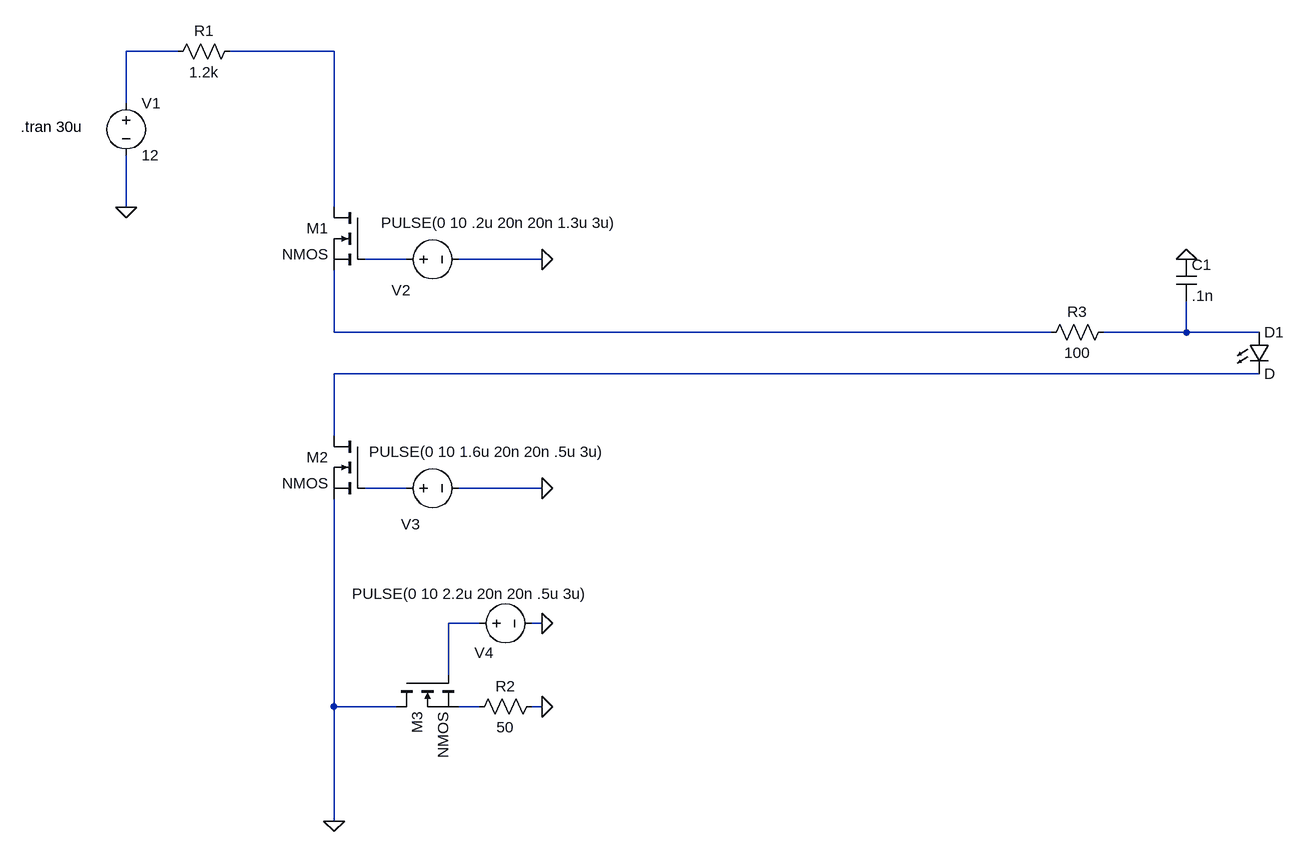
[diagram p0: schematic Draft3.asc]
Draft3.asc, the LTspice schematic file:
Version 4
SHEET 1 1732 1268
WIRE -768 64 -848 64
WIRE -528 64 -688 64
WIRE -848 144 -848 64
WIRE -848 304 -848 224
WIRE -528 304 -528 64
WIRE -416 384 -480 384
WIRE -208 384 -336 384
WIRE -528 496 -528 400
WIRE 576 496 -528 496
WIRE 784 496 784 448
WIRE 784 496 656 496
WIRE 896 496 784 496
WIRE 896 560 -528 560
WIRE -528 656 -528 560
WIRE -416 736 -480 736
WIRE -208 736 -336 736
WIRE -304 944 -352 944
WIRE -208 944 -224 944
WIRE -352 1024 -352 944
WIRE -528 1072 -528 752
WIRE -432 1072 -528 1072
WIRE -304 1072 -336 1072
WIRE -208 1072 -224 1072
WIRE -528 1248 -528 1072
FLAG -208 384 0
FLAG -848 304 0
FLAG -208 736 0
FLAG -208 944 0
FLAG -208 1072 0
FLAG 784 384 0
FLAG -528 1248 0
SYMBOL voltage -848 128 R0
WINDOW 123 0 0 Left 0
WINDOW 39 0 0 Left 0
SYMATTR InstName V1
SYMATTR Value 12
SYMBOL voltage -432 384 R270
WINDOW 0 -63 7 VTop 2
WINDOW 3 72 159 VBottom 2
WINDOW 123 0 0 Left 0
WINDOW 39 0 0 Left 0
SYMATTR InstName V2
SYMATTR Value PULSE(0 10 .2u 20n 20n 1.3u 3u)
SYMBOL nmos -480 304 M0
SYMATTR InstName M1
SYMBOL res -672 48 R90
WINDOW 0 0 56 VBottom 2
WINDOW 3 32 56 VTop 2
SYMATTR InstName R1
SYMATTR Value 1.2k
SYMBOL nmos -480 656 M0
SYMATTR InstName M2
SYMBOL voltage -432 736 R270
WINDOW 0 -55 7 VRight 2
WINDOW 3 56 -42 VRight 2
WINDOW 123 0 0 Left 0
WINDOW 39 0 0 Left 0
SYMATTR InstName V3
SYMATTR Value PULSE(0 10 1.6u 20n 20n .5u 3u)
SYMBOL nmos -432 1024 M90
SYMATTR InstName M3
SYMBOL res -208 1056 R90
WINDOW 0 0 56 VBottom 2
WINDOW 3 32 56 VTop 2
SYMATTR InstName R2
SYMATTR Value 50
SYMBOL voltage -320 944 R270
WINDOW 0 -45 8 VRight 2
WINDOW 3 46 -180 VRight 2
WINDOW 123 0 0 Left 0
WINDOW 39 0 0 Left 0
SYMATTR InstName V4
SYMATTR Value PULSE(0 10 2.2u 20n 20n .5u 3u)
SYMBOL LED 880 496 R0
SYMATTR InstName D1
SYMBOL cap 768 384 R0
SYMATTR InstName C1
SYMATTR Value .1n
SYMBOL res 672 480 R90
WINDOW 0 0 56 VBottom 2
WINDOW 3 32 56 VTop 2
SYMATTR InstName R3
SYMATTR Value 100
TEXT -1010 180 Left 2 !.tran 30u

The netlist it stands for:
* Draft3.asc
V1 N001 0 12
V2 N003 0 PULSE(0 10 .2u 20n 20n 1.3u 3u)
M1 N002 N003 N004 N004 NMOS
R1 N002 N001 1.2k
M2 N006 N007 0 0 NMOS
V3 N007 0 PULSE(0 10 1.6u 20n 20n .5u 3u)
M3 0 N008 N009 N009 NMOS
R2 0 N009 50
V4 N008 0 PULSE(0 10 2.2u 20n 20n .5u 3u)
D1 N005 N006 D
C1 0 N005 .1n
R3 N005 N004 100
.model D D
.lib standard.dio
.model NMOS NMOS
.model PMOS PMOS
.lib standard.mos
.tran 30u
.backanno
.end